# Altium project LED strip driver.PrjPcb
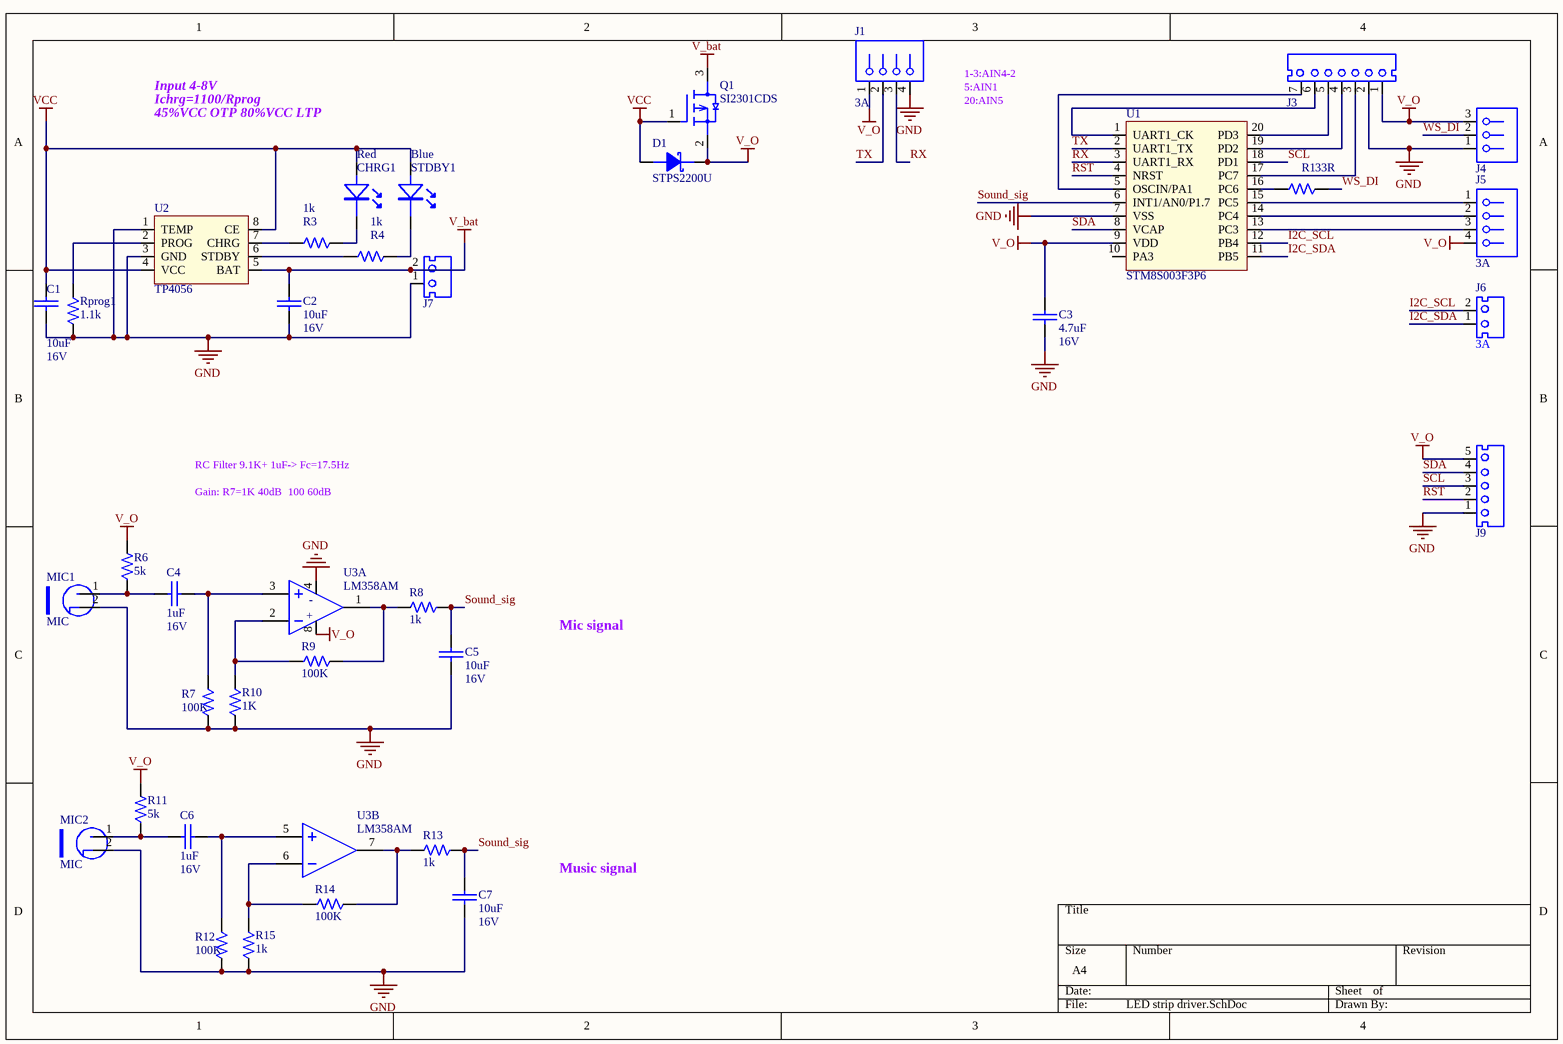
[diagram p0: LED strip driver.SchDoc]
1 sheet, 37 parts. Net scope: global (net labels, ports and power ports of the same name join across sheets).
Board file: LED strip driver.PcbDoc

## Sheet LED strip driver.SchDoc
size A4; SheetNumber: 1; SheetTotal: 1

### Parts
C1  value 10uF  Voltage: 16V  [CAPC0402-RW]  (hidden comment: T542011037308)
C2  value 10uF  Voltage: 16V  [CAPC0402-RW]  (hidden comment: T542011037308)
C3  value 4.7uF  Voltage: 16V  [CAPC0402-RW]  (hidden comment: T542011037308)
C4  value 1uF  Voltage: 16V  [CAPC0402-RW]  (hidden comment: T542011037308)
C5  value 10uF  Voltage: 16V  [CAPC0402-RW]  (hidden comment: T542011037308)
C6  value 1uF  Voltage: 16V  [CAPC0402-RW]  (hidden comment: T542011037308)
C7  value 10uF  Voltage: 16V  [CAPC0402-RW]  (hidden comment: T542011037308)
CHRG1  Color: Red  [LED1206-RED]  (hidden comment: LED1206R_23-21\R6C-AM1N2AY\2A)
D1  MFG Part: STPS2200U  [SMB]  (hidden comment: DIO STPS2200U)
J1  Current: 3A  [CONN 4P PH=2.5mm RA WHITE HAA250A-4]  (hidden comment: CCN250010-0504)
J3  CCN250000-0107  [CONN 7P PH=2.5MM ST WAFER]  (value not drawn)
J4  CCN250000-0503  [CONN 3P PH=2.5mm HAA250A-3 90]  (value not drawn)
J5  Current: 3A  [CONN 4P PH=2.5mm RA WHITE HAA250A-4]  (hidden comment: CCN250010-0504)
J6  Current: 3A  [CONN 2P PH=2.5mm B2B-XH-A]  (hidden comment: CCN250000-0102)
J7  T690300125300  [CONN 2P PH=2.5mm HAA250A-2 WHITE]  (value not drawn)
J9  T690300112400  [CONN 5P PH=2.5mm TJC3-5A-CS]  (value not drawn)
MIC1  MIC  [MIC-6022]
MIC2  MIC  [MIC-6022]
Q1  SI2301CDS  [SOT23-132-RW]
R1  value 33R  [0402-RW]  (hidden comment: QCF167240-1000)
R3  value 1k  [0402-RW]  (hidden comment: QCF167240-1000)
R4  value 1k  [0402-RW]  (hidden comment: QCF167240-1000)
R6  value 5k  [0402-RW]  (hidden comment: QCF167240-1000)
R7  value 100K  [0402-RW]  (hidden comment: QCF167240-1000)
R8  value 1k  [0402-RW]  (hidden comment: QCF167240-1000)
R9  value 100K  [0402-RW]  (hidden comment: QCF167240-1000)
R10  value 1K  [0402-RW]  (hidden comment: QCF167240-1000)
R11  value 5k  [0402-RW]  (hidden comment: QCF167240-1000)
R12  value 100K  [0402-RW]  (hidden comment: QCF167240-1000)
R13  value 1k  [0402-RW]  (hidden comment: QCF167240-1000)
R14  value 100K  [0402-RW]  (hidden comment: QCF167240-1000)
R15  value 1k  [0402-RW]  (hidden comment: QCF167240-1000)
Rprog1  value 1.1k  [0402-RW]  (hidden comment: QCF167240-1000)
STDBY1  Color: Blue  [LED1206-RED]  (hidden comment: LED1206R_23-21\R6C-AM1N2AY\2A)
U1  MFG Part: STM8S003F3P6  [TSSOP20]  (hidden comment: RCI800336-0001)
U2  MFG Part: TP4056  [SO8]  (hidden comment: RCI240512-0001)
U3  RCI000358-0001  [SO8]  (value not drawn)  (parts A,B of 2)

### Nets
GND: C1.2 C2.2 C3.2 C5.1 C7.1 J1.4 J3.2 J4.1 J7.1 J9.1 MIC1.2(GND) MIC2.2(GND) R7.2 R10.2 R12.2 R15.2 Rprog1.2 U1.7(VSS) U2.1(TEMP) U2.3(GND) U3.4
V_bat: C2.1 J7.2 Q1.3(D) U2.5(BAT)
V_O: C3.1 D1.2(K) J1.1 J3.1 J4.3 J5.4 J9.5 Q1.2(S) R6.2 R11.2 U1.9(VDD) U3.8
VCC: C1.1 CHRG1.1(A) D1.1(A) Q1.1(G) STDBY1.1(A) U2.4(VCC) U2.8(CE)
I2C_SCL: J6.2 U1.12(PB4)
I2C_SDA: J6.1 U1.11(PB5)
RST: J9.2 U1.4(NRST)
RX: J1.3 U1.3(UART1_RX)
SCL: J9.3 U1.18(PD1)
SDA: J9.4 U1.8(VCAP)
Sound_sig: C5.2 C7.2 R8.1 R13.1 U1.6(INT1/AN0/P1.7)
TX: J1.2 U1.2(UART1_TX)
WS_DI: J4.2 R1.2
NetC4_1: C4.1 MIC1.1(VCC) R6.1
NetC4_2: C4.2 R7.1 U3.3(IN+)
NetC6_1: C6.1 MIC2.1(VCC) R11.1
NetC6_2: C6.2 R12.1 U3.5(IN+)
NetCHRG1_2: CHRG1.2(K) R3.2
NetJ3_3: J3.3 U1.17(PC7)
NetJ3_4: J3.4 U1.19(PD2)
NetJ3_5: J3.5 U1.20(PD3)
NetJ3_6: J3.6 U1.1(UART1_CK)
NetJ3_7: J3.7 U1.5(OSCIN/PA1)
NetJ5_1: J5.1 U1.15(PC5)
NetJ5_2: J5.2 U1.14(PC4)
NetJ5_3: J5.3 U1.13(PC3)
NetR1_1: R1.1 U1.16(PC6)
NetR3_1: R3.1 U2.7(CHRG)
NetR4_1: R4.1 U2.6(STDBY)
NetR4_2: R4.2 STDBY1.2(K)
NetR8_2: R8.2 R9.2 U3.1(OUT)
NetR9_1: R9.1 R10.1 U3.2(IN-)
NetR13_2: R13.2 R14.2 U3.7(OUT)
NetR14_1: R14.1 R15.1 U3.6(IN-)
NetRprog1_1: Rprog1.1 U2.2(PROG)

Not connected (* = marked no-connect by the designer): U1 10(PA3)

### Notes on the sheet
- Input 4-8V
- Ichrg=1100/Rprog
- 45%VCC OTP 80%VCC LTP
- 1-3:AIN4-2
- 5:AIN1
- 20:AIN5
- RC Filter 9.1K+ 1uF-> Fc=17.5Hz
- Gain: R7=1K 40dB  100 60dB
- Mic signal
- Music signal
- (in symbol LM358AM, part A) -; +

### Library data of the parts
C1-C7 = CAP0402 0.01uF 16V 10%_X7R_WALSIN: CAP X7R .01UF 16V +-10% 0402 WALSIN L; MFG Part: 0402B103K160; Tolerance: 10%; Type: Capacitor; CREATE_NAME: Nathan; DIP&SMD: SMD; SAP: T542011037308; PACKAGE: CAPC0402; Vendor Name: *; MFG: WALSIN; Other: X7R; CREATE_TIME: 10-Jan-2020; Customer Specific: N/A
CHRG1 STDBY1 = LED1206R_23-21\R6C-AM1N2AY\2A: CHIP LED RED TYPE 1206; MFG: EVERLIGHT; DIP&SMD: SMD; CREATE_NAME: Nathan; MFG Part: 23-21\R6C-AM1N2AY\2A; SAP: *; Package: 1206; Type: LED; CREATE_TIME: 18-Aug-2020
D1 = DIO STPS2200U: DIODE SCHOTTKY 200V 2A SMB; MFG: STMicroelectronics; DIP&SMD: SMD; CREATE_NAME: Nathan; SAP: *; Vendor Name: *; Vendor Code: *; Voltage: *; Current: *; Type: DIODE; Customer Specific: N/A; CREATE_TIME: 19-Jun-2020; Package: SMB
J1 J5 = CONN 4P PH=2.5mm  RA WHITE HAA250A-4: CONN. 4P P=2.5mm 90' HAA250A-4 RA WHITE; MFG Part: HAA250A-4 WHITE; Value: 2.5mm; SAP: T690300038000; MFG: 金科基; DIP&SMD: DIP; Vendor Name: *; Vendor Code: *; Type: Connector
J3 = CONN 7P PH=2.5mm B4B-XH-A ST: GP CONNECTOR B4B-XH-A 7 PIN G; SAP: T690300029200; MFG: 金瑞康; CREATE_NAME: Nathan; DIP&SMD: DIP; Vendor Name: *; Vendor Code: *; Type: Connector; CREATE_TIME: 24-Sep-2014; MFG Part: B4B-XH-A
J4 = CONN 3P PH=2.5mm HAA250A-3 90: CONNECTOR 3PIN P=2.5 White 90'; SAP: T690300023700; MFG: 金科基; CREATE_NAME: TOM@Deftronics; DIP&SMD: DIP; Vendor Name: *; Vendor Code: *; Type: Connector; CREATE_TIME: 16-Apr-2014; MFG Part: *
J6 = CONN 2P PH=2.5mm B2B-XH-A: GP CONNECTOR B2B-XH-A 2 PIN G; MFG Part: HAA250A-2A-WHITE; Value: 2.5mm; SAP: T690300041200; MFG: 金瑞康; Vendor Name: 亿源电子有限公司; Vendor Code: 10009989; DIP&SMD: DIP; Type: Connector
J7 = CONN 2P PH=2.5mm HAA250A-2 BLACK: CONNECTOR HA2.5 2PIN BLACK K; Value: 2.5mm; MFG: 金瑞康; CREATE_NAME: Nathan; Current: 3A; DIP&SMD: DIP; SAP: T690300125300; MFG Part: HAA250A-2 BLACK; Vendor Name: *; Vendor Code: *; Type: Connector; CREATE_TIME: 24-Nov-2017
J9 = CONN 5P PH=2.5mm TJC3-5A-CS: CONNECTOR 5PIN P:2.5MM WHITE M180 K; Value: 2.5mm; MFG: JIN JIA; CREATE_NAME: Nathan; DIP&SMD: DIP; SAP: T690300112400; MFG Part: TJC3-5A-CS; Vendor Name: *; Vendor Code: *; Type: Connector; Current: *; CREATE_TIME: 18-July-2017
Q1 = SI2301CDS: PMOS FET-Si2301CDS; MFG: VISHAY; CREATE_NAME: Nathan; DIP&SMD: SMD; SAP: *; Power: *; Vendor Code: *; Vendor Name: *; Voltage: *; Current: *; Type: PMOS; CREATE_TIME: 17-Nov-2020; Customer Specific: N/A; Package: SOT23; MFG Part: SI2301CDS
R1 R3 R4 R6-R15 Rprog1 = RES0402 1/16W 0.1% 100 OHM: CHIP RES 100 OHM 1/16W 0.1% 0402; SAP: T501100001129; CREATE_NAME: TOM@Deftronics; DIP&SMD: SMD; Package: 0402; MFG Part: *; MFG: *; Vendor Code: *; Vendor Name: *; Type: Resistor; Power: 1/16W; CREATE_TIME: 05-Jun-2014; Customer Specific: N/A
U1 = N76E003: IC MCU 20P TSSOP20; MFG: ST; SAP: T610300083725; CREATE_NAME: GordonL@Deftronics; DIP&SMD: SMD; Vendor Code: *; Vendor Name: *; Type: IC; CREATE_TIME: 23-Mar-2014; Customer Specific: N/A
U2 = 24LC512: IC 8P 24LC512T-I/SN  SO-8; SAP: T610100064201; MFG: MICROCHIP; Vendor Code: 10020271; Vendor Name: MICROCHIP TECHNOLOGY IRELAND LTD; DIP&SMD: SMD; Type: IC; Customer Specific: N/A
U3 = LM358AM: IC OP-AMP Dual LM358 DUAL OP-AMP SOIC8; SAP: T610500008001; Vendor Code: 10020355; Vendor Name: SERIAL MICROELECTRONICS (HK) LIMITE; MFG: National SEMI; DIP&SMD: SMD; Type: IC AMP; Customer Specific: N/A; MFG Part: LM358AM